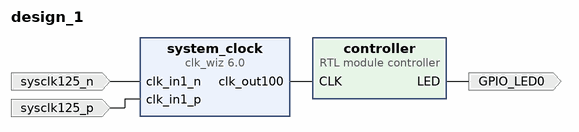
[diagram p0: block diagram of the top level]
# Vivado block design design_1, xczu7ev-ffvc1156-2-e, Vivado 2021.1
create_bd_design design_1

create_bd_port -dir I -type clk sysclk125_n
set_property -dict {CONFIG.FREQ_HZ 125000000} [get_bd_ports sysclk125_n]
create_bd_port -dir I -type clk sysclk125_p
set_property -dict {CONFIG.FREQ_HZ 125000000} [get_bd_ports sysclk125_p]
create_bd_port -dir O GPIO_LED0

create_bd_cell -type ip -vlnv xilinx.com:ip:clk_wiz:6.0 system_clock
set_property -dict [list \
  CONFIG.CLKIN1_JITTER_PS 80.0 \
  CONFIG.CLKOUT1_DRIVES BUFGCE \
  CONFIG.CLKOUT1_JITTER 177.983 \
  CONFIG.CLKOUT1_PHASE_ERROR 222.305 \
  CONFIG.CLKOUT2_DRIVES BUFGCE \
  CONFIG.CLKOUT3_DRIVES BUFGCE \
  CONFIG.CLKOUT4_DRIVES BUFGCE \
  CONFIG.CLKOUT5_DRIVES BUFGCE \
  CONFIG.CLKOUT6_DRIVES BUFGCE \
  CONFIG.CLKOUT7_DRIVES BUFGCE \
  CONFIG.CLK_OUT1_PORT clk_out100 \
  CONFIG.FEEDBACK_SOURCE FDBK_AUTO \
  CONFIG.MMCM_CLKFBOUT_MULT_F 48.000 \
  CONFIG.MMCM_CLKIN1_PERIOD 8.000 \
  CONFIG.MMCM_DIVCLK_DIVIDE 5 \
  CONFIG.OPTIMIZE_CLOCKING_STRUCTURE_EN true \
  CONFIG.PRIM_IN_FREQ 125 \
  CONFIG.PRIM_SOURCE Differential_clock_capable_pin \
  CONFIG.USE_LOCKED false \
  CONFIG.USE_RESET false \
  CONFIG.USE_SAFE_CLOCK_STARTUP true \
] [get_bd_cells system_clock]
create_bd_cell -type module -reference controller controller

# ---- connections ----

connect_bd_net -net clk_in1_n_0_1 [get_bd_ports sysclk125_n] [get_bd_pins system_clock/clk_in1_n]
connect_bd_net -net clk_in1_p_0_1 [get_bd_ports sysclk125_p] [get_bd_pins system_clock/clk_in1_p]
connect_bd_net [get_bd_pins controller/LED] [get_bd_ports GPIO_LED0]
connect_bd_net [get_bd_pins system_clock/clk_out100] [get_bd_pins controller/CLK]

validate_bd_design
save_bd_design
